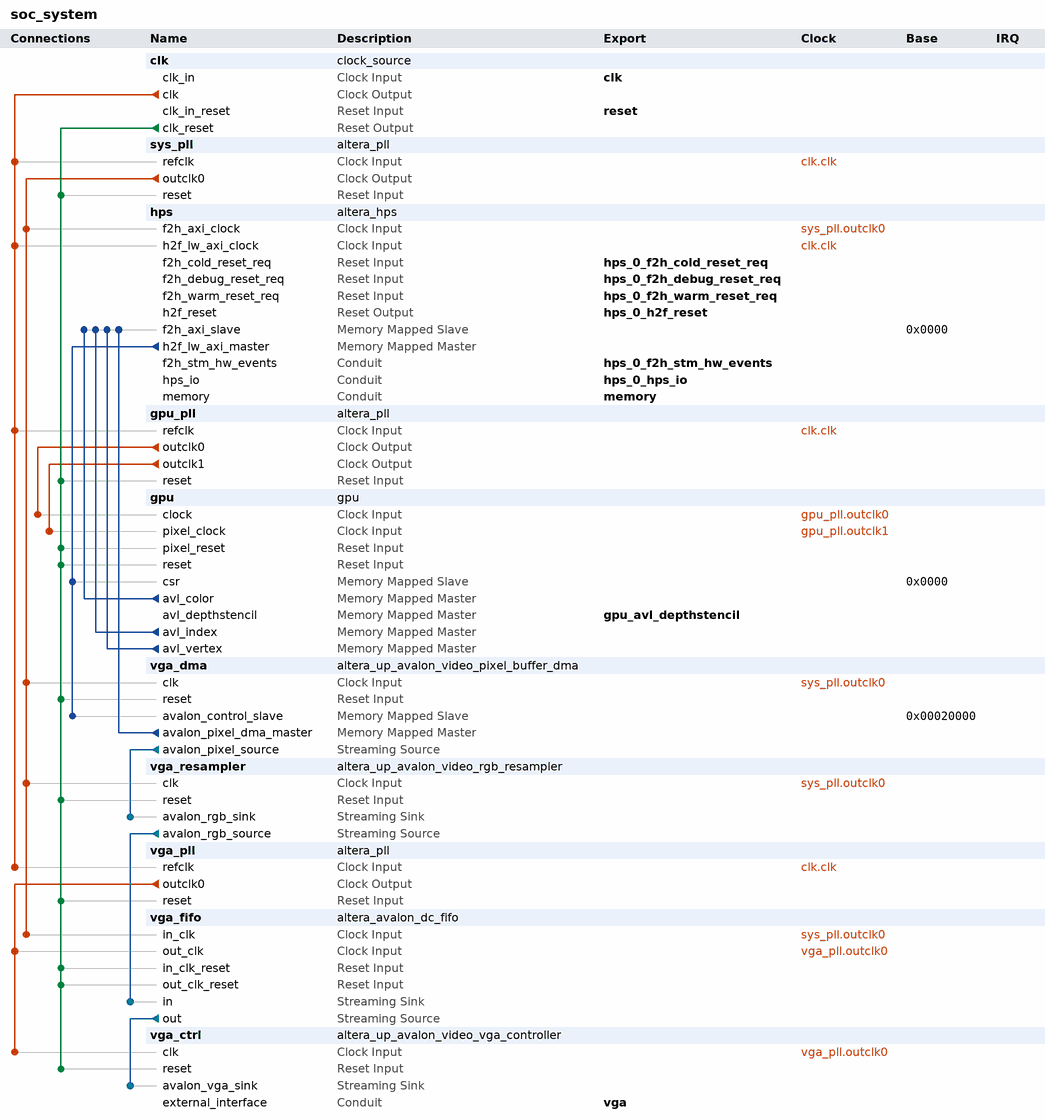
[diagram p0: system contents]
# Platform Designer (Qsys) system soc_system, Cyclone V 5CSEMA5F31C6
# Parameters at their usual value, and those the tool derives, are not listed.
package require -exact qsys 24.1
create_system soc_system
set_project_property DEVICE_FAMILY {Cyclone V}
set_project_property DEVICE 5CSEMA5F31C6

add_instance clk clock_source 24.1
set_instance_parameter_value clk clockFrequency 50000000

add_instance sys_pll altera_pll 24.1
set_instance_parameter_value sys_pll gui_device_speed_grade 1
set_instance_parameter_value sys_pll gui_number_of_clocks 1
set_instance_parameter_value sys_pll gui_operation_mode direct
set_instance_parameter_value sys_pll gui_output_clock_frequency0 140.0
set_instance_parameter_value sys_pll gui_pll_mode {Integer-N PLL}
set_instance_parameter_value sys_pll gui_reference_clock_frequency 50.0
set_instance_parameter_value sys_pll gui_use_locked false

add_instance hps altera_hps 24.1
set_instance_parameter_value hps EMAC1_Mode RGMII
set_instance_parameter_value hps EMAC1_PinMuxing {HPS I/O Set 0}
set_instance_parameter_value hps F2SCLK_COLDRST_Enable true
set_instance_parameter_value hps F2SCLK_DBGRST_Enable true
set_instance_parameter_value hps F2SCLK_WARMRST_Enable true
set_instance_parameter_value hps F2SINTERRUPT_Enable true
set_instance_parameter_value hps F2S_Width 1
set_instance_parameter_value hps FPGA_PERIPHERAL_OUTPUT_CLOCK_FREQ_EMAC0_GTX_CLK 100
set_instance_parameter_value hps FPGA_PERIPHERAL_OUTPUT_CLOCK_FREQ_EMAC0_MD_CLK 100.0
set_instance_parameter_value hps FPGA_PERIPHERAL_OUTPUT_CLOCK_FREQ_EMAC1_GTX_CLK 100
set_instance_parameter_value hps FPGA_PERIPHERAL_OUTPUT_CLOCK_FREQ_EMAC1_MD_CLK 100.0
set_instance_parameter_value hps HPS_PROTOCOL DDR3
set_instance_parameter_value hps I2C0_Mode I2C
set_instance_parameter_value hps I2C0_PinMuxing {HPS I/O Set 0}
set_instance_parameter_value hps I2C1_Mode I2C
set_instance_parameter_value hps I2C1_PinMuxing {HPS I/O Set 0}
set_instance_parameter_value hps LWH2F_Enable true
set_instance_parameter_value hps MEM_BANKADDR_WIDTH 3
set_instance_parameter_value hps MEM_CLK_FREQ 533.3333
set_instance_parameter_value hps MEM_CLK_FREQ_MAX 1066.667
set_instance_parameter_value hps MEM_COL_ADDR_WIDTH 10
set_instance_parameter_value hps MEM_DQ_WIDTH 32
set_instance_parameter_value hps MEM_DRV_STR RZQ/7
set_instance_parameter_value hps MEM_ROW_ADDR_WIDTH 15
set_instance_parameter_value hps MEM_RTT_NOM RZQ/4
set_instance_parameter_value hps MEM_RTT_WR RZQ/4
set_instance_parameter_value hps MEM_TCL 11
set_instance_parameter_value hps MEM_TFAW_NS 30.0
set_instance_parameter_value hps MEM_TRAS_NS 35.0
set_instance_parameter_value hps MEM_TRCD_NS 13.75
set_instance_parameter_value hps MEM_TRFC_NS 260.0
set_instance_parameter_value hps MEM_TRP_NS 13.75
set_instance_parameter_value hps MEM_VENDOR JEDEC
set_instance_parameter_value hps MEM_WTCL 8
set_instance_parameter_value hps QSPI_Mode {1 SS}
set_instance_parameter_value hps QSPI_PinMuxing {HPS I/O Set 0}
set_instance_parameter_value hps REF_CLK_FREQ 25.0
set_instance_parameter_value hps S2FCLK_USER2CLK 5
set_instance_parameter_value hps S2F_Width 0
set_instance_parameter_value hps SDIO_Mode {4-bit Data}
set_instance_parameter_value hps SDIO_PinMuxing {HPS I/O Set 0}
set_instance_parameter_value hps SPIM1_Mode {Single Slave Select}
set_instance_parameter_value hps SPIM1_PinMuxing {HPS I/O Set 0}
set_instance_parameter_value hps STM_Enable true
set_instance_parameter_value hps TIMING_BOARD_AC_SKEW 0.03
set_instance_parameter_value hps TIMING_BOARD_AC_TO_CK_SKEW 0.0
set_instance_parameter_value hps TIMING_BOARD_DQ_TO_DQS_SKEW 0.0
set_instance_parameter_value hps TIMING_BOARD_MAX_CK_DELAY 0.03
set_instance_parameter_value hps TIMING_BOARD_MAX_DQS_DELAY 0.02
set_instance_parameter_value hps TIMING_BOARD_SKEW_BETWEEN_DQS 0.08
set_instance_parameter_value hps TIMING_BOARD_SKEW_CKDQS_DIMM_MAX 0.16
set_instance_parameter_value hps TIMING_BOARD_SKEW_CKDQS_DIMM_MIN 0.09
set_instance_parameter_value hps TIMING_BOARD_SKEW_WITHIN_DQS 0.01
set_instance_parameter_value hps TIMING_TDH 65
set_instance_parameter_value hps TIMING_TDQSCK 255
set_instance_parameter_value hps TIMING_TDQSQ 125
set_instance_parameter_value hps TIMING_TDS 30
set_instance_parameter_value hps TIMING_TIH 140
set_instance_parameter_value hps TIMING_TIS 180
set_instance_parameter_value hps TIMING_TQSH 0.4
set_instance_parameter_value hps UART0_Mode {No Flow Control}
set_instance_parameter_value hps UART0_PinMuxing {HPS I/O Set 0}
set_instance_parameter_value hps USB1_Mode SDR
set_instance_parameter_value hps USB1_PinMuxing {HPS I/O Set 0}
set_instance_parameter_value hps desired_cfg_clk_mhz 100.0
set_instance_parameter_value hps desired_qspi_clk_mhz 400.0

add_instance gpu_pll altera_pll 24.1
set_instance_parameter_value gpu_pll gui_device_speed_grade 1
set_instance_parameter_value gpu_pll gui_number_of_clocks 2
set_instance_parameter_value gpu_pll gui_operation_mode direct
set_instance_parameter_value gpu_pll gui_output_clock_frequency0 32.5
set_instance_parameter_value gpu_pll gui_output_clock_frequency1 65.0
set_instance_parameter_value gpu_pll gui_pll_mode {Integer-N PLL}
set_instance_parameter_value gpu_pll gui_reference_clock_frequency 50.0
set_instance_parameter_value gpu_pll gui_use_locked false

add_instance gpu gpu 1.2

add_instance vga_dma altera_up_avalon_video_pixel_buffer_dma 18.0
set_instance_parameter_value vga_dma addr_mode Consecutive
set_instance_parameter_value vga_dma back_start_address 1023410176
set_instance_parameter_value vga_dma color_space {32-bit RGBA}
set_instance_parameter_value vga_dma image_height 480
set_instance_parameter_value vga_dma image_width 640
set_instance_parameter_value vga_dma start_address 1006632960

add_instance vga_resampler altera_up_avalon_video_rgb_resampler 18.0
set_instance_parameter_value vga_resampler alpha 1023
set_instance_parameter_value vga_resampler input_type {32-bit RGBA}
set_instance_parameter_value vga_resampler output_type {30-bit RGB}

add_instance vga_pll altera_pll 24.1
set_instance_parameter_value vga_pll gui_device_speed_grade 1
set_instance_parameter_value vga_pll gui_number_of_clocks 1
set_instance_parameter_value vga_pll gui_operation_mode direct
set_instance_parameter_value vga_pll gui_output_clock_frequency0 25.0
set_instance_parameter_value vga_pll gui_pll_mode {Integer-N PLL}
set_instance_parameter_value vga_pll gui_reference_clock_frequency 50.0
set_instance_parameter_value vga_pll gui_use_locked false

add_instance vga_fifo altera_avalon_dc_fifo 24.1
set_instance_parameter_value vga_fifo BITS_PER_SYMBOL 10
set_instance_parameter_value vga_fifo FIFO_DEPTH 1024
set_instance_parameter_value vga_fifo SYMBOLS_PER_BEAT 3
set_instance_parameter_value vga_fifo USE_PACKETS 1

add_instance vga_ctrl altera_up_avalon_video_vga_controller 18.0
set_instance_parameter_value vga_ctrl board DE1-SoC
set_instance_parameter_value vga_ctrl resolution {VGA 640x480}

# connections
add_connection clk.clk gpu_pll.refclk clock
add_connection clk.clk hps.h2f_lw_axi_clock clock
add_connection clk.clk sys_pll.refclk clock
add_connection clk.clk vga_pll.refclk clock
add_connection gpu_pll.outclk0 gpu.clock clock
add_connection gpu_pll.outclk1 gpu.pixel_clock clock
add_connection sys_pll.outclk0 hps.f2h_axi_clock clock
add_connection sys_pll.outclk0 vga_dma.clk clock
add_connection sys_pll.outclk0 vga_fifo.in_clk clock
add_connection sys_pll.outclk0 vga_resampler.clk clock
add_connection vga_pll.outclk0 vga_ctrl.clk clock
add_connection vga_pll.outclk0 vga_fifo.out_clk clock
add_connection clk.clk_reset gpu.pixel_reset reset
add_connection clk.clk_reset gpu.reset reset
add_connection clk.clk_reset gpu_pll.reset reset
add_connection clk.clk_reset sys_pll.reset reset
add_connection clk.clk_reset vga_ctrl.reset reset
add_connection clk.clk_reset vga_dma.reset reset
add_connection clk.clk_reset vga_fifo.in_clk_reset reset
add_connection clk.clk_reset vga_fifo.out_clk_reset reset
add_connection clk.clk_reset vga_pll.reset reset
add_connection clk.clk_reset vga_resampler.reset reset
add_connection gpu.avl_color hps.f2h_axi_slave avalon
set_connection_parameter_value gpu.avl_color/hps.f2h_axi_slave baseAddress 0x0000
add_connection gpu.avl_index hps.f2h_axi_slave avalon
set_connection_parameter_value gpu.avl_index/hps.f2h_axi_slave baseAddress 0x0000
add_connection gpu.avl_vertex hps.f2h_axi_slave avalon
set_connection_parameter_value gpu.avl_vertex/hps.f2h_axi_slave baseAddress 0x0000
add_connection hps.h2f_lw_axi_master gpu.csr avalon
set_connection_parameter_value hps.h2f_lw_axi_master/gpu.csr baseAddress 0x0000
add_connection hps.h2f_lw_axi_master vga_dma.avalon_control_slave avalon
set_connection_parameter_value hps.h2f_lw_axi_master/vga_dma.avalon_control_slave baseAddress 0x00020000
add_connection vga_dma.avalon_pixel_dma_master hps.f2h_axi_slave avalon
set_connection_parameter_value vga_dma.avalon_pixel_dma_master/hps.f2h_axi_slave baseAddress 0x0000
add_connection vga_dma.avalon_pixel_source vga_resampler.avalon_rgb_sink avalon_streaming
add_connection vga_fifo.out vga_ctrl.avalon_vga_sink avalon_streaming
add_connection vga_resampler.avalon_rgb_source vga_fifo.in avalon_streaming

# exported interfaces
add_interface clk clock sink
set_interface_property clk EXPORT_OF clk.clk_in
add_interface gpu_avl_depthstencil avalon master
set_interface_property gpu_avl_depthstencil EXPORT_OF gpu.avl_depthstencil
add_interface hps_0_f2h_cold_reset_req reset sink
set_interface_property hps_0_f2h_cold_reset_req EXPORT_OF hps.f2h_cold_reset_req
add_interface hps_0_f2h_debug_reset_req reset sink
set_interface_property hps_0_f2h_debug_reset_req EXPORT_OF hps.f2h_debug_reset_req
add_interface hps_0_f2h_stm_hw_events conduit end
set_interface_property hps_0_f2h_stm_hw_events EXPORT_OF hps.f2h_stm_hw_events
add_interface hps_0_f2h_warm_reset_req reset sink
set_interface_property hps_0_f2h_warm_reset_req EXPORT_OF hps.f2h_warm_reset_req
add_interface hps_0_h2f_reset reset source
set_interface_property hps_0_h2f_reset EXPORT_OF hps.h2f_reset
add_interface hps_0_hps_io conduit end
set_interface_property hps_0_hps_io EXPORT_OF hps.hps_io
add_interface memory conduit end
set_interface_property memory EXPORT_OF hps.memory
add_interface reset reset sink
set_interface_property reset EXPORT_OF clk.clk_in_reset
add_interface vga conduit end
set_interface_property vga EXPORT_OF vga_ctrl.external_interface

set_interconnect_requirement {$system} qsys_mm.clockCrossingAdapter AUTO
set_interconnect_requirement {$system} qsys_mm.enableInstrumentation FALSE
set_interconnect_requirement {$system} qsys_mm.maxAdditionalLatency 2
set_interconnect_requirement fb.control qsys_mm.insertPerformanceMonitor FALSE
set_interconnect_requirement gpu.avl_color qsys_mm.insertPerformanceMonitor FALSE
set_interconnect_requirement new_target new_requirement_name new_requirement_value
set_interconnect_requirement new_target new_requirement_name_0 new_requirement_value
set_interconnect_requirement new_target new_requirement_name_1 new_requirement_value
set_interconnect_requirement new_target new_requirement_name_2 new_requirement_value
set_interconnect_requirement new_target new_requirement_name_3 new_requirement_value
set_interconnect_requirement new_target new_requirement_name_4 new_requirement_value

save_system soc_system.qsys
